# Altium schematic sheet TopSheet.SchDoc
size A4; CompanyName: Technische Hochschule Nürnberg Georg Simon Ohm; Organization: UltraZohm; Address1: Kesslerplatz 12; Address2: 90489 Nürnberg; Address3: GERMANY; DocumentNumber: 2; SheetNumber: 1; SheetTotal: 3; Website: www.ultrazohm.com
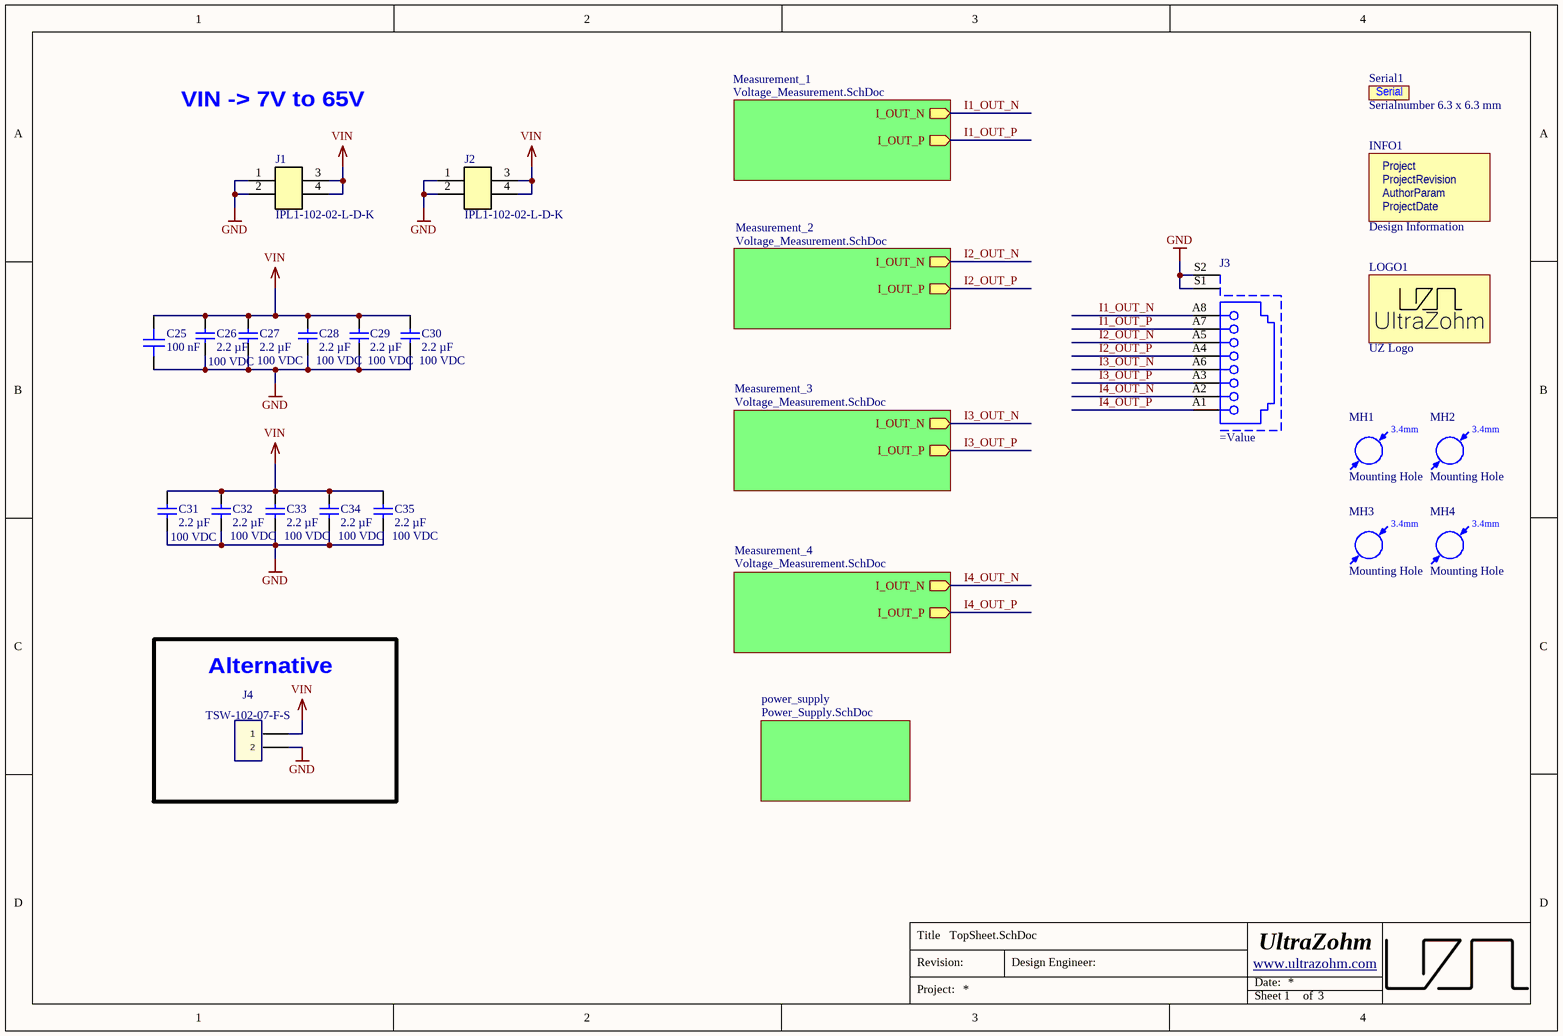
[diagram p0: TopSheet.SchDoc]

## Parts
C25  100 nF  [C_0603]
C26  2.2 µF  Voltage Rating: 100 VDC  [C_1210_TE]
C27  2.2 µF  Voltage Rating: 100 VDC  [C_1210_TE]
C28  2.2 µF  Voltage Rating: 100 VDC  [C_1210_TE]
C29  2.2 µF  Voltage Rating: 100 VDC  [C_1210_TE]
C30  2.2 µF  Voltage Rating: 100 VDC  [C_1210_TE]
C31  2.2 µF  Voltage Rating: 100 VDC  [C_1210_TE]
C32  2.2 µF  Voltage Rating: 100 VDC  [C_1210_TE]
C33  2.2 µF  Voltage Rating: 100 VDC  [C_1210_TE]
C34  2.2 µF  Voltage Rating: 100 VDC  [C_1210_TE]
C35  2.2 µF  Voltage Rating: 100 VDC  [C_1210_TE]
INFO1  Design Information  [Design_info]  (no BOM)
J1  IPL1-102-02-L-D-K  [IPL1-102-02-L-D-K-0]
J2  IPL1-102-02-L-D-K  [IPL1-102-02-L-D-K-0]
J3  (no value)  [R-RJ45R10P-B000]
J4  TSW-102-07-F-S  [TSW-102-XX-XXX-S]
LOGO1  UZ Logo  [UZ_Logo_small]  (no BOM)
MH1  Mounting Hole  [MH_3.4]  (no BOM)
MH2  Mounting Hole  [MH_3.4]  (no BOM)
MH3  Mounting Hole  [MH_3.4]  (no BOM)
MH4  Mounting Hole  [MH_3.4]  (no BOM)
Serial1  Serialnumber 6.3 x 6.3 mm  [SERIAL_6.3X6.3MM]  (no BOM)

## Blocks framed on the sheet
Alternative: J4

## Sub-sheets
Measurement_1 = Voltage_Measurement.SchDoc: I_OUT_P (out), I_OUT_N (out)
Measurement_2 = Voltage_Measurement.SchDoc: I_OUT_P (out), I_OUT_N (out)
Measurement_3 = Voltage_Measurement.SchDoc: I_OUT_P (out), I_OUT_N (out)
Measurement_4 = Voltage_Measurement.SchDoc: I_OUT_P (out), I_OUT_N (out)
power_supply = Power_Supply.SchDoc: no entries

## Nets
GND: C25.2 C26.2 C27.2 C28.2 C29.2 C30.2 C31.2 C32.2 C33.2 C34.2 C35.2 J1.1 J1.2 J2.1 J2.2 J3.S1 J3.S2 J4.2
VIN: C25.1 C26.1 C27.1 C28.1 C29.1 C30.1 C31.1 C32.1 C33.1 C34.1 C35.1 J1.3 J1.4 J2.3 J2.4 J4.1
I1_OUT_N: J3.A8 ; sheet Measurement_1/I_OUT_N
I1_OUT_P: J3.A7 ; sheet Measurement_1/I_OUT_P
I2_OUT_N: J3.A5 ; sheet Measurement_2/I_OUT_N
I2_OUT_P: J3.A4 ; sheet Measurement_2/I_OUT_P
I3_OUT_N: J3.A6 ; sheet Measurement_3/I_OUT_N
I3_OUT_P: J3.A3 ; sheet Measurement_3/I_OUT_P
I4_OUT_N: J3.A2 ; sheet Measurement_4/I_OUT_N
I4_OUT_P: J3.A1 ; sheet Measurement_4/I_OUT_P

## Notes on the sheet
- VIN -> 7V to 65V
- Title
- Revision:
- Design Engineer:
- Date:
- Project:
- Sheet
- of
- (in symbol Design Information) Project; ProjectRevision; AuthorParam; ProjectDate
- (in symbol Mounting Hole) 3.4mm
- (in symbol Serial Number) Serial

## Library data of the parts
C25 = C1608X7S2A104KT000N: 100V 100nF X7S ±10% 0603 Multilayer Ceramic Capacitors MLCC - SMD/SMT ROHS; Manufacturer: TDK; Voltage Rating: 100 VDC; Created from: AGeiger; Value: 100 nF; Supplier 1: LCSC; Supplier Part Number 1: C343025; Tolerance: 10 %; LCSC Part Number: C343025; Manufacturer Part Number: C1608X7S2A104KT000N; PartID: 148; Created On: 20/12/2020 13:54:13; ComponentLink1Description: Datasheet; ComponentLink1URL: https://datasheet.lcsc.com/lcsc/2304140030_TDK-C1608X7S2A104KT000N_C343025.pdf; Component Type: Capacitor 0603; Device Package: 0603; Last Updated: 14/12/2022 12:14:21; Mounting Type: SMD; Operating Temperature: -55 to 125°C; Series: X7R; Type: Capacitor; Live Cycle Status: 1; Stock number: not stored
C26-C35 = FS32X225K101EGG: 100V 2.2uF X7R ±10% 1210 Multilayer Ceramic Capacitors MLCC - SMD/SMT ROHS; Manufacturer: PSA(Prosperity Dielectrics); Created from: AGeiger; Manufacturer Part Number: FS32X225K101EGG; PartID: 170; Created On: 11.03.2025 16:22:30; ComponentLink1Description: Datasheet; ComponentLink1URL: https://www.lcsc.com/datasheet/lcsc_datasheet_2410121308_PSA-Prosperity-Dielectrics-FS32X225K101EGG_C153036.pdf; Component Type: Capacitor 1210; Device Package: 1210; Last Updated: 27.05.2025 19:11:48; Mounting Type: SMD; Operating Temperature: -55 to +125°C; Series: FS; Supplier 1: LCSC; Supplier Part Number 1: C153036; Type: Capacitor; Tolerance: 10%; Value: 2.2 µF; Live Cycle Status: 1; LCSC Part Number: C153036
INFO1 = Design Information: Design InformationS; Manufacturer: UltraZohm; Created from: MGremer; Manufacturer Part Number: Design Information; PartID: 12; Created On: 03.11.2021 09:04:23; ComponentLink1Description: https://docs.ultrazohm.com/; ComponentLink1URL: homepage; Component Type: Design Information; Last Updated: 03.11.2021 09:28:34; Supplier 1: -; Supplier Part Number 1: -; Type: Design Information; Value: Design Information; Live Cycle Status: 1
J1 J2 = IPL1-102-02-L-D-K: P=2.54mm Wire To Board Connector ROHS; Manufacturer: SAMTEC; Created from: KIlhan; Number of positions: 2; Manufacturer Part Number: IPL1-102-02-L-D-K; PartID: 59; Created On: 20/03/2025 08:58:37; ComponentLink1Description: Datasheet; ComponentLink1URL: https://wmsc.lcsc.com/wmsc/upload/file/pdf/v2/lcsc/2312312026_Samtec-IPL1-102-02-L-D-K_C7437440.pdf; Component Type: Samtec Connector; Device Package: Connector; Last Updated: 20/03/2025 09:02:48; Mounting Type: THT; Operating Temperature: -55 - +125 °C; Supplier 1: Mouser; Supplier Part Number 1: 200-IPL110202LDK; Supplier 2: LCSC; Supplier Part Number 2: C7437440; Type: Connector; Live Cycle Status: 1; Number of rows: 2; LCSC Part Number: C7437440; Stock number: not stored
J3 = R-RJ45R10P-B000: RJ45Receptacle 1 Shielded Bend insert Without LED 0℃~+70℃ Plugin Ethernet Connectors / Modular Connectors (RJ45 RJ11) ROHS; Manufacturer: Ckmtw(Shenzhen Cankemeng); Created from: KIlhan; Manufacturer Part Number: R-RJ45R10P-B000; PartID: 57; Created On: 20/03/2025 09:19:07; ComponentLink1Description: Datasheet; ComponentLink1URL: https://jlcpcb.com/api/file/downloadByFileSystemAccessId/8588892085580021760; Last Updated: 20/03/2025 13:46:21; Mounting Type: THT; Operating Temperature: 0℃~+70℃; Series: RJ45; Supplier 1: LCSC; Supplier Part Number 1: C386758; Value: R-RJ45R10P-B000; LCSC Part Number: C386758
J4 = TSW-102-07-F-S: Pin Header, 2.54mm, 2x1; MANUFACTURER: SAMTEC; Created from: AGeiger; Number of positions: 2; CREATED BY: May 18, 2016 - Wendy Xin; PCB DECAL: TSW-102-XX-XXX-S; Manufacturer Part Number: TSW-102-07-F-S; PartID: 13; Created On: 02/12/2022 15:20:24; ComponentLink1Description: Datasheet; ComponentLink1URL: https://suddendocs.samtec.com/catalog_english/tsw_th.pdf; Component Type: Pin Header; Device Package: THT; Last Updated: 02/12/2022 15:20:30; Mounting Type: THT; Operating Temperature: -55 to +125 °C; Series: TSW; Supplier 1: Mouser; Supplier Part Number 1: 200-TSW10207FS; Type: Pin Header; Live Cycle Status: 1; Stock number: not stored; Number of rows: 1
LOGO1 = Logo small: Manufacturer: UltraZohm; Created from: MGremer; Created: Jan2021_Liegmann; Value: Logo; Manufacturer Part Number: Logo small; PartID: 10; Created On: 03.11.2021 09:04:23; ComponentLink1Description: https://docs.ultrazohm.com/; ComponentLink1URL: homepage; Component Type: Logo; Last Updated: 03.11.2021 09:05:50; Supplier 1: -; Supplier Part Number 1: -; Type: Logo; Live Cycle Status: 1
MH1-MH4 = Mounting Hole: Created from: MHlatky; Manufacturer Part Number: Mounting Hole; PartID: 16; Created On: 26.01.2021 09:19:51; ComponentLink1Description: Datasheet; Component Type: Mounting Hole; Device Package: -; Last Updated: 21.03.2022 23:05:12; Manufacturer: Mounting Hole; Supplier 1: Mounting Hole; Supplier Part Number 1: Mounting Hole; Type: Mounting Hole; Value: Mounting Hole; Live Cycle Status: 1; Stock number: not stored
Serial1 = Serial Number: Manufacturer: UltraZohm; Value: REV; Created from: MGremer; Created: 2018_09_18_AGeiger; Manufacturer Part Number: Serial Number; PartID: 11; Created On: 03.11.2021 09:04:23; ComponentLink1Description: https://docs.ultrazohm.com/; ComponentLink1URL: homepage; Component Type: Serial Number; Last Updated: 03.11.2021 09:28:34; Supplier 1: -; Supplier Part Number 1: -; Type: Serial Number; Live Cycle Status: 1